# EasyEDA schematic schematic.json
TITLE: Shuffl+ with Battery Support; REV: 1.0; Date: 2024-10-06; Sheet: 1/1; Drawn By: @eshangonemad (github); Company: StarKloud
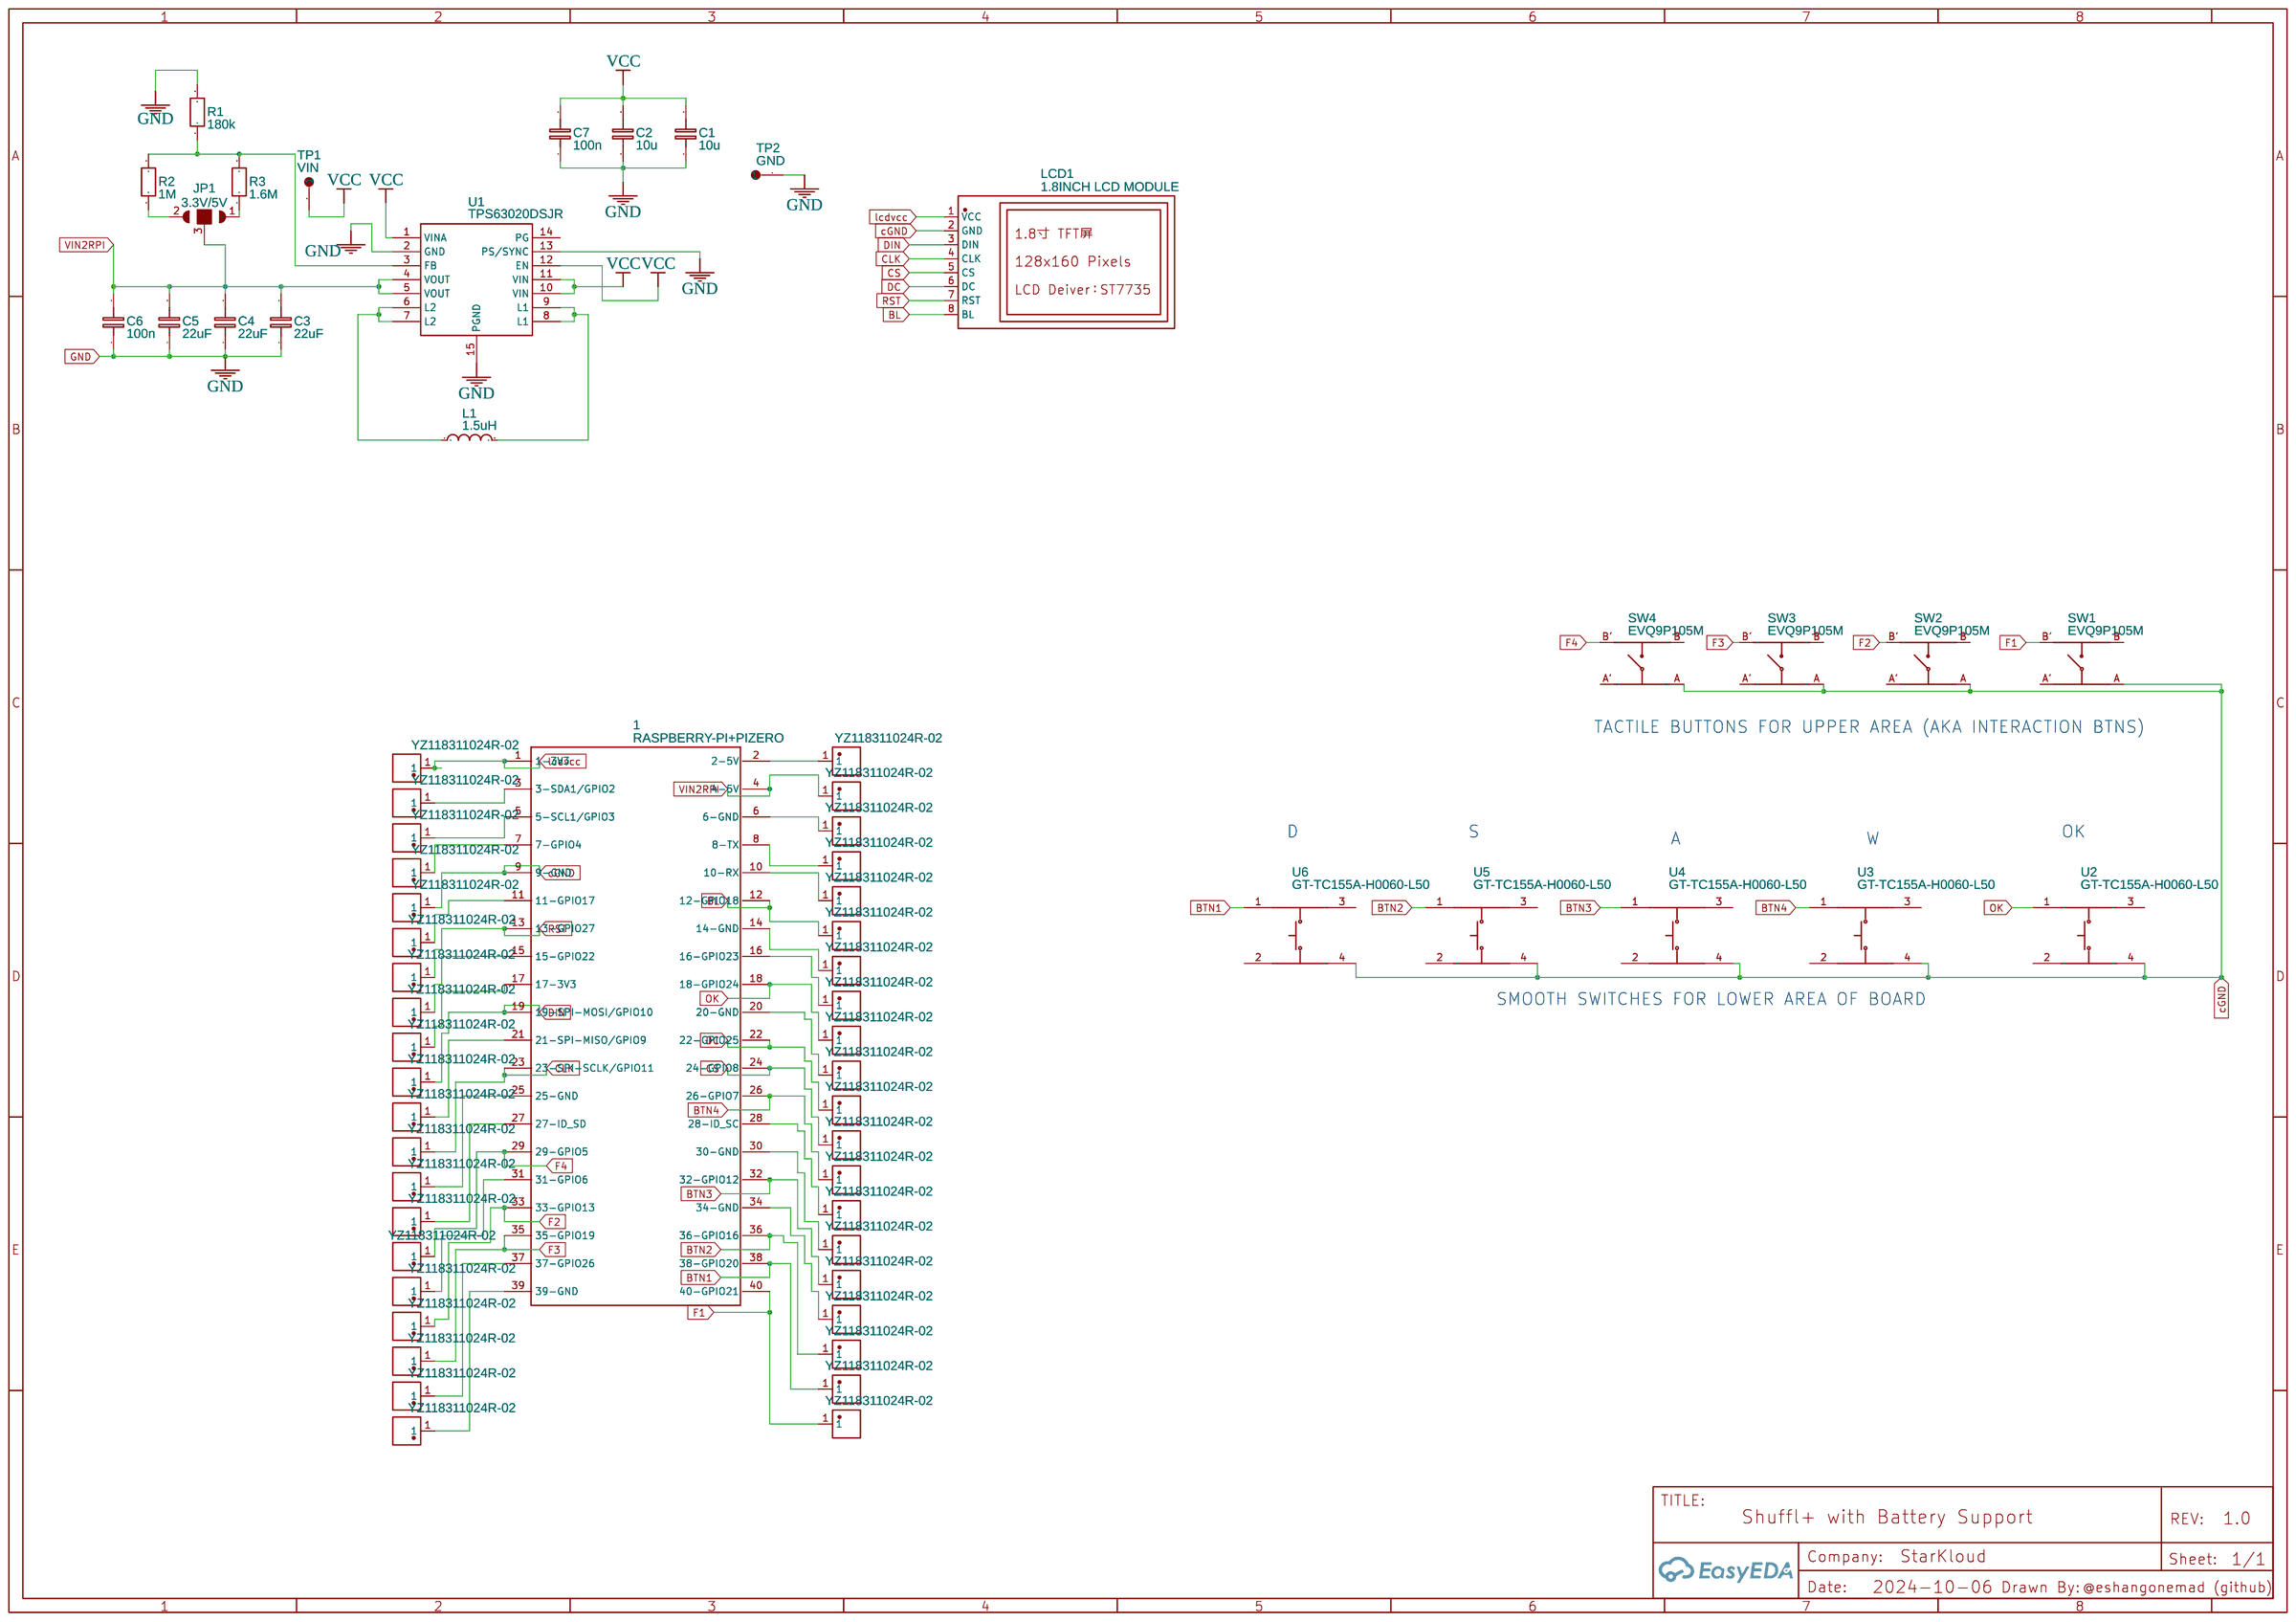
[diagram p0: schematic sheet]

## Parts
1  RASPBERRY-PI+PIZERO  [RASPBERRY-PI-ZERO]
2  YZ118311024R-02  [CONN-SMD_BD1.2_YZ118311024R-02]
3  YZ118311024R-02  [CONN-SMD_BD1.2_YZ118311024R-02]
4  YZ118311024R-02  [CONN-SMD_BD1.2_YZ118311024R-02]
5  YZ118311024R-02  [CONN-SMD_BD1.2_YZ118311024R-02]
6  YZ118311024R-02  [CONN-SMD_BD1.2_YZ118311024R-02]
7  YZ118311024R-02  [CONN-SMD_BD1.2_YZ118311024R-02]
8  YZ118311024R-02  [CONN-SMD_BD1.2_YZ118311024R-02]
9  YZ118311024R-02  [CONN-SMD_BD1.2_YZ118311024R-02]
10  YZ118311024R-02  [CONN-SMD_BD1.2_YZ118311024R-02]
11  YZ118311024R-02  [CONN-SMD_BD1.2_YZ118311024R-02]
12  YZ118311024R-02  [CONN-SMD_BD1.2_YZ118311024R-02]
13  YZ118311024R-02  [CONN-SMD_BD1.2_YZ118311024R-02]
14  YZ118311024R-02  [CONN-SMD_BD1.2_YZ118311024R-02]
15  YZ118311024R-02  [CONN-SMD_BD1.2_YZ118311024R-02]
16  YZ118311024R-02  [CONN-SMD_BD1.2_YZ118311024R-02]
17  YZ118311024R-02  [CONN-SMD_BD1.2_YZ118311024R-02]
18  YZ118311024R-02  [CONN-SMD_BD1.2_YZ118311024R-02]
19  YZ118311024R-02  [CONN-SMD_BD1.2_YZ118311024R-02]
20  YZ118311024R-02  [CONN-SMD_BD1.2_YZ118311024R-02]
21  YZ118311024R-02  [CONN-SMD_BD1.2_YZ118311024R-02]
22  YZ118311024R-02  [CONN-SMD_BD1.2_YZ118311024R-02]
23  YZ118311024R-02  [CONN-SMD_BD1.2_YZ118311024R-02]
24  YZ118311024R-02  [CONN-SMD_BD1.2_YZ118311024R-02]
25  YZ118311024R-02  [CONN-SMD_BD1.2_YZ118311024R-02]
26  YZ118311024R-02  [CONN-SMD_BD1.2_YZ118311024R-02]
27  YZ118311024R-02  [CONN-SMD_BD1.2_YZ118311024R-02]
28  YZ118311024R-02  [CONN-SMD_BD1.2_YZ118311024R-02]
29  YZ118311024R-02  [CONN-SMD_BD1.2_YZ118311024R-02]
30  YZ118311024R-02  [CONN-SMD_BD1.2_YZ118311024R-02]
31  YZ118311024R-02  [CONN-SMD_BD1.2_YZ118311024R-02]
32  YZ118311024R-02  [CONN-SMD_BD1.2_YZ118311024R-02]
33  YZ118311024R-02  [CONN-SMD_BD1.2_YZ118311024R-02]
34  YZ118311024R-02  [CONN-SMD_BD1.2_YZ118311024R-02]
35  YZ118311024R-02  [CONN-SMD_BD1.2_YZ118311024R-02]
36  YZ118311024R-02  [CONN-SMD_BD1.2_YZ118311024R-02]
37  YZ118311024R-02  [CONN-SMD_BD1.2_YZ118311024R-02]
38  YZ118311024R-02  [CONN-SMD_BD1.2_YZ118311024R-02]
39  YZ118311024R-02  [CONN-SMD_BD1.2_YZ118311024R-02]
40  YZ118311024R-02  [CONN-SMD_BD1.2_YZ118311024R-02]
C1  10u  [C0805]
C2  10u  [C0805]
C3  22uF  [C0805]
C4  22uF  [C0805]
C5  22uF  [C0805]
C6  100n  [C0805]
C7  100n  [C0805]
GP1  YZ118311024R-02  [CONN-SMD_BD1.2_YZ118311024R-02]
JP1  3.3V/5V  [SOLDER BRIDGE 3P UNBRIDGED]
L1  1.5uH  [IND-SMD_L4.1-W4.1_ASFPIG4020]
LCD1  1.8INCH LCD MODULE  [LCD-TH_L56.5-W34.0_1-8INCH-LCD-MODULE]
R1  180k  [R0805]
R2  1M  [R0805]
R3  1.6M  [R0805]
SW1  EVQ9P105M  [KEY-SMD_4P-L6.1-W6.0-P4.50-LS7.4]
SW2  EVQ9P105M  [KEY-SMD_4P-L6.1-W6.0-P4.50-LS7.4]
SW3  EVQ9P105M  [KEY-SMD_4P-L6.1-W6.0-P4.50-LS7.4]
SW4  EVQ9P105M  [KEY-SMD_4P-L6.1-W6.0-P4.50-LS7.4]
TP1  VIN  [PKG-TEST-POINT-PTH-1X1]
TP2  GND  [PKG-TEST-POINT-PTH-1X1]
U1  TPS63020DSJR  [VSON-14_L4.0-W3.0-P0.50-BL-EP_TI_DSJ]
U2  GT-TC155A-H0060-L50  [SW-SMD_4P-G-SWITCH-GT-TC155A-H0060-L50]
U3  GT-TC155A-H0060-L50  [SW-SMD_4P-G-SWITCH-GT-TC155A-H0060-L50]
U4  GT-TC155A-H0060-L50  [SW-SMD_4P-G-SWITCH-GT-TC155A-H0060-L50]
U5  GT-TC155A-H0060-L50  [SW-SMD_4P-G-SWITCH-GT-TC155A-H0060-L50]
U6  GT-TC155A-H0060-L50  [SW-SMD_4P-G-SWITCH-GT-TC155A-H0060-L50]

## Library data of the parts
1 = RASPBERRY-PI+PIZERO: Contributor: Simmy27
2-40 GP1 = YZ118311024R-02: Supplier: LCSC; Supplier Part: C5157376; Manufacturer: Xinyangze(鑫扬泽); JLCPCB Part Class: Extended Part; Contributor: lcsc
C1-C7 = C_0805_EU: Contributor: LCEDA_Lib
JP1 = SOLDER BRIDGE: Contributor: leif
L1 = ASPIAIG-F4020-R56M-T: Contributor: LCSC; Supplier: LCSC; Supplier Part: C1335186; Manufacturer: ABRACON; JLCPCB Part Class: Extended Part; link: https://lcsc.com/eda_search?q=C1335186&%26type=1&ref=editor
LCD1 = 1.8INCH LCD MODULE: Supplier: LCSC; Supplier Part: C359940; Manufacturer: Waveshare(微雪电子); Manufacturer Part: 1.8inch LCD Module; JLCPCB Part Class: Extended Part; Contributor: lcsc
R1-R3 = R_0805_EU: Contributor: LCEDA_Lib
SW1-SW4 = EVQ9P105M: Contributor: LCSC; Supplier: LCSC; Manufacturer: PANASONIC(松下); Supplier Part: C79157; JLCPCB Part Class: Extended Part
TP1 TP2 = TEST-POINT-PTH-1X1
U1 = TPS63020DSJR: Supplier: LCSC; Manufacturer: TI(德州仪器); Supplier Part: C15483; JLCPCB Part Class: Extended Part; link: https://lcsc.com/eda_search?q=C15483&%26type=1&ref=editor
U2-U6 = GT-TC155A-H0060-L50: Contributor: lcsc; Supplier: LCSC; Supplier Part: C5155556; Manufacturer: G-Switch(品赞); JLCPCB Part Class: Extended Part

## Nets
GND: C1.1 C2.1 C3.1 C4.1 C5.1 C6.1 C7.1 R1.2 TP2.1 U1.2(GND) U1.13(PS/SYNC) U1.15(PGND)
VCC: C1.2 C2.2 C7.2 TP1.1 U1.1(VINA) U1.10(VIN) U1.11(VIN) U1.12(EN)
VIN2RPI: 1.4(4-5V) 4.1 C3.2 C4.2 C5.2 C6.2 JP1.3 U1.4(VOUT) U1.5(VOUT)
BL: 1.12(12-GPIO18) 12.1 LCD1.8(BL)
BTN1: 1.38(38-GPIO20) 38.1 U6.1
BTN2: 1.36(36-GPIO16) 36.1 U5.1
BTN3: 1.32(32-GPIO12) 32.1 U4.1
BTN4: 1.26(26-GPIO7) 26.1 U3.1
cGND: 1.9(9-GND) 9.1 LCD1.2(GND) SW1.A SW2.A SW3.A SW4.A U2.4 U3.4 U4.4 U5.4 U6.4
CLK: 1.23(23-SPI-SCLK/GPIO11) 23.1 LCD1.4(CLK)
CS: 1.24(24-GPIO8) 24.1 LCD1.5(CS)
DC: 1.22(22-GPIO25) 22.1 LCD1.6(DC)
DIN: 1.19(19-SPI-MOSI/GPIO10) 19.1 LCD1.3(DIN)
F1: 1.40(40-GPIO21) 40.1 SW1.B'(B')
F2: 1.33(33-GPIO13) 33.1 SW2.B'(B')
F3: 1.35(35-GPIO19) 35.1 SW3.B'(B')
F4: 1.29(29-GPIO5) 29.1 SW4.B'(B')
lcdvcc: 1.1(1-3V3) GP1.1 LCD1.1(VCC)
OK: 1.18(18-GPIO24) 18.1 U2.1
RST: 1.13(13-GPIO27) 13.1 LCD1.7(RST)
Net-(1-2): 1.2(2-5V) 2.1
Net-(1-3): 1.3(3-SDA1/GPIO2) 3.1
Net-(1-5): 1.5(5-SCL1/GPIO3) 5.1
Net-(1-6): 1.6(6-GND) 6.1
Net-(1-7): 1.7(7-GPIO4) 7.1
Net-(1-8): 1.8(8-TX) 8.1
Net-(1-10): 1.10(10-RX) 10.1
Net-(1-11): 1.11(11-GPIO17) 11.1
Net-(1-14): 1.14(14-GND) 14.1
Net-(1-15): 1.15(15-GPIO22) 15.1
Net-(1-16): 1.16(16-GPIO23) 16.1
Net-(1-17): 1.17(17-3V3) 17.1
Net-(1-20): 1.20(20-GND) 20.1
Net-(1-21): 1.21(21-SPI-MISO/GPIO9) 21.1
Net-(1-25): 1.25(25-GND) 25.1
Net-(1-27): 1.27(27-ID_SD) 27.1
Net-(1-28): 1.28(28-ID_SC) 28.1
Net-(1-30): 1.30(30-GND) 30.1
Net-(1-31): 1.31(31-GPIO6) 31.1
Net-(1-34): 1.34(34-GND) 34.1
Net-(1-37): 1.37(37-GPIO26) 37.1
Net-(1-39): 1.39(39-GND) 39.1
Net-(JP1-1): JP1.1 R3.1
Net-(JP1-2): JP1.2 R2.1
Net-(L1-1): L1.1 U1.6(L2) U1.7(L2)
Net-(L1-2): L1.2 U1.8(L1) U1.9(L1)
Net-(R1-1): R1.1 R2.2 R3.2 U1.3(FB)

Not connected (* = marked no-connect by the designer): SW1 A'(A') B; SW2 A'(A') B; SW3 A'(A') B; SW4 A'(A') B; U1 14(PG); U2 2 3; U3 2 3; U4 2 3; U5 2 3; U6 2 3

## Notes on the sheet
- TACTILE BUTTONS FOR UPPER AREA (AKA INTERACTION BTNS)
- D
- S
- A
- W
- OK
- SMOOTH SWITCHES FOR LOWER AREA OF BOARD
